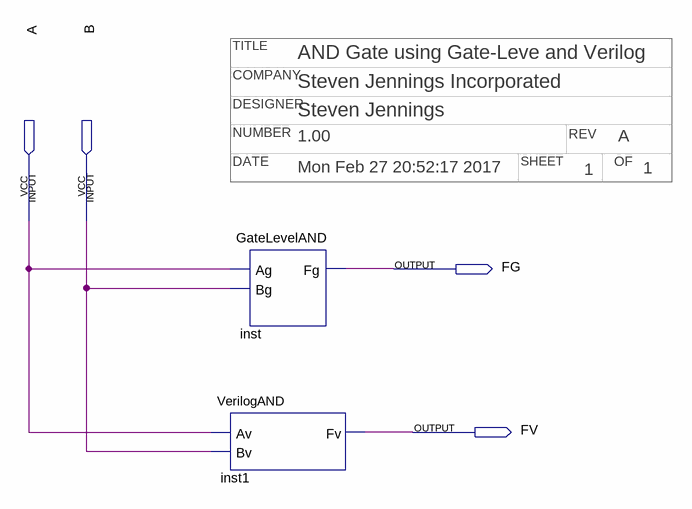
[diagram p0: schematic sheet]
// Quartus schematic AndGate.bdf as structural Verilog: 2 symbols, 4 pins
// Title block: COMPANY: Steven Jennings Incorporated; DATE: Mon Feb 27 20:52:17 2017; DESIGNER: Steven Jennings; NUMBER: 1.00; OF: 1; REV: A; SHEET: 1; TITLE: AND Gate using Gate-Leve and Verilog
module AndGate (
  input  A,
  input  B,
  output FG,
  output FV
);

  GateLevelAND inst (.Ag(A), .Bg(B), .Fg(FG));
  VerilogAND inst1 (.Av(A), .Bv(B), .Fv(FV));
endmodule
